# Altium schematic sheet RVPOVP.SchDoc
size A; DocumentNumber: 4; SheetNumber: 4; SheetTotal: 12
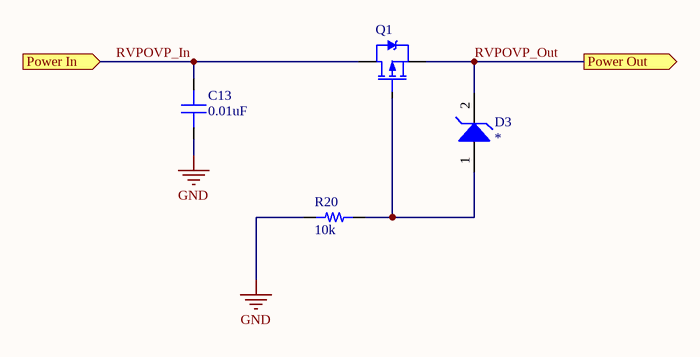
[diagram p0: RVPOVP.SchDoc]

## Parts
C13  capacitance: 0.01uF  [0603]  (hidden comment: capacitor)
D3  *  [SOD123F]
Q1  DMP3010LK3-13  [DMP3010LK3-13]  (value not drawn)
R20  10k  [RES 0603/1608]

## Ports
Power In (in), Power Out (out)

## Nets
GND: C13.1 R20.1
RVPOVP_In: C13.2 Q1.3(D) ; port Power In
RVPOVP_Out: D3.2(K) Q1.2(S) ; port Power Out
NetD3_1: D3.1(A) Q1.1(G) R20.2

## Library data of the parts
C13 = 1: Generic 0603 capacitor; id: 1; voltage: 50; dielectric: Ceramic; percent tolerance: 10; name: 0603 Capacitor; ESR: 1; package: 0603; quantity: 0
D3 = 10: Zener Diode 14V 500mW ±5% Surface Mount SOD-1; id: 10; name: DDZ9701; MfrPartNo: *; package: SOD-123; quantity: 0; link: https://www.digikey.com/product-detail/en/diodes-incorporated/DDZ9701-7/DDZ9701-7DICT-ND/3877402
Q1 = 26: P-Channel MOSFET 30V 17A TO252; Manufacturer_id: 1; idFuse: 3; id: 26; type: P_Channel; vdsmax: 30; rdson: 8mOhm; vgsmax: 20; Drawer_id: 1; Name: DMP3010LK3-13; numcircuits: 1; current: 17A; package: TO-252-3; quantity: 0; link: https://www.digikey.com/product-detail/en/diodes-incorporated/DMP3010LK3-13/DMP3010LK3-13DICT-ND/3076574; createdby: Kevin
R20 = 1: id: 1; name: 0603 Resistor; percent tolerance: 5; resistance: 10k; package: 0603; quantity: 0